# EAGLE design axiom_beta_plugin_module_3xmDP_v1.2_r1.4 (EAGLE 7.0.0)
Assembly variants: Beta
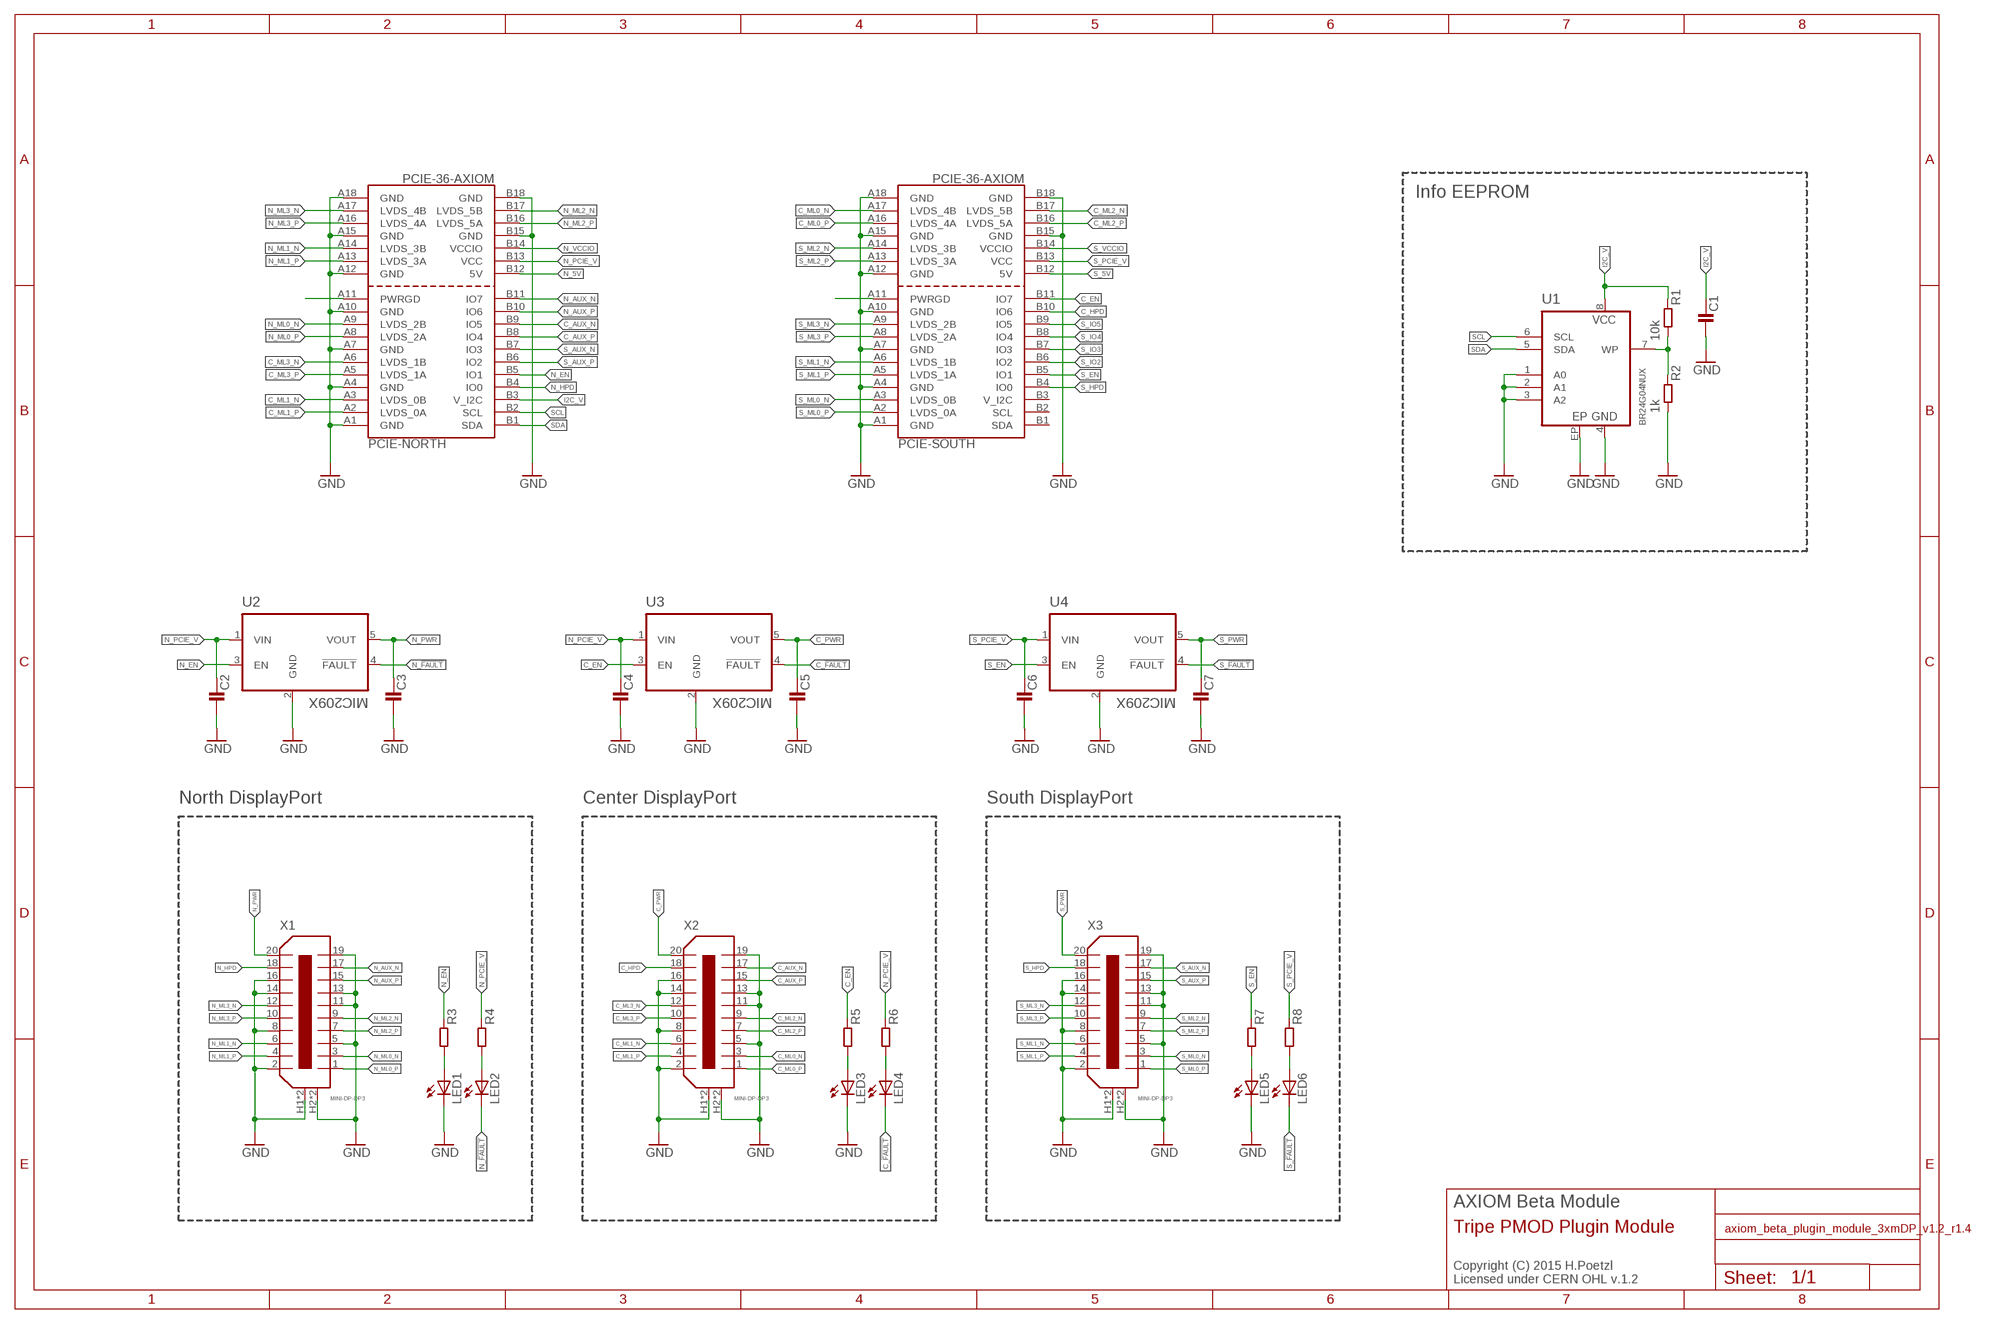
[diagram p0: schematic, sheet 1]

## Parts
C1  C0402-B  [0402-B]
C2  C0603-B  [0603-B]
C3  C0603-B  [0603-B]
C4  C0603-B  [0603-B]
C5  C0603-B  [0603-B]
C6  C0603-B  [0603-B]
C7  C0603-B  [0603-B]
LED1  LEDCHIPLED_0603  [CHIPLED_0603]
LED2  LEDCHIPLED_0603  [CHIPLED_0603]
LED3  LEDCHIPLED_0603  [CHIPLED_0603]
LED4  LEDCHIPLED_0603  [CHIPLED_0603]
LED5  LEDCHIPLED_0603  [CHIPLED_0603]
LED6  LEDCHIPLED_0603  [CHIPLED_0603]
PCIE-NORTH  PCIE-36-AXIOM  [PCIE-36-AXIOM]  (not fitted in variant Beta)
PCIE-SOUTH  PCIE-36-AXIOM  [PCIE-36-AXIOM]  (not fitted in variant Beta)
R1  10k  R0402-B  [0402-B]
R2  1k  R0402-B  [0402-B]
R3  R0402-B  [0402-B]
R4  R0402-B  [0402-B]
R5  R0402-B  [0402-B]
R6  R0402-B  [0402-B]
R7  R0402-B  [0402-B]
R8  R0402-B  [0402-B]
U1  BR24G04NUX  [DFN200X300X100-9N]
U2  MIC209X  [SOT95P280X145-5N]
U3  MIC209X  [SOT95P280X145-5N]
U4  MIC209X  [SOT95P280X145-5N]
X1  MINI-DP-DP3  [JAE-DP3]
X2  MINI-DP-DP3  [JAE-DP3]
X3  MINI-DP-DP3  [JAE-DP3]

## Nets
C_!FAULT: LED4.C U3.4(!FAULT)
C_AUX_N: PCIE-NORTH.B9(IO5) X2.17
C_AUX_P: PCIE-NORTH.B8(IO4) X2.15
C_EN: PCIE-SOUTH.B11(IO7) R5.1 U3.3(EN)
C_HPD: PCIE-SOUTH.B10(IO6) X2.18
C_ML0_N: PCIE-SOUTH.A17(LVDS_4B) X2.3
C_ML0_P: PCIE-SOUTH.A16(LVDS_4A) X2.1
C_ML1_N: PCIE-NORTH.A3(LVDS_0B) X2.6
C_ML1_P: PCIE-NORTH.A2(LVDS_0A) X2.4
C_ML2_N: PCIE-SOUTH.B17(LVDS_5B) X2.9
C_ML2_P: PCIE-SOUTH.B16(LVDS_5A) X2.7
C_ML3_N: PCIE-NORTH.A6(LVDS_1B) X2.12
C_ML3_P: PCIE-NORTH.A5(LVDS_1A) X2.10
C_PWR: C5.1 U3.5(VOUT) X2.20
GND: C1.2 C2.2 C3.2 C4.2 C5.2 C6.2 C7.2 LED1.C LED3.C LED5.C PCIE-NORTH.A1(GND) PCIE-NORTH.A4(GND) PCIE-NORTH.A7(GND) PCIE-NORTH.A10(GND) PCIE-NORTH.A12(GND) PCIE-NORTH.A15(GND) PCIE-NORTH.A18(GND) PCIE-NORTH.B15(GND) PCIE-NORTH.B18(GND) PCIE-SOUTH.A1(GND) PCIE-SOUTH.A4(GND) PCIE-SOUTH.A7(GND) PCIE-SOUTH.A10(GND) PCIE-SOUTH.A12(GND) PCIE-SOUTH.A15(GND) PCIE-SOUTH.A18(GND) PCIE-SOUTH.B15(GND) PCIE-SOUTH.B18(GND) R2.2 U1.1(A0) U1.2(A1) U1.3(A2) U1.4(GND) U1.EP U2.2(GND) U3.2(GND) U4.2(GND) X1.2 X1.5 X1.8 X1.11 X1.13 X1.14 X1.16 X1.19 X1.H1(M) X1.H2(M) X1.H3(M) X1.H4(M) X2.2 X2.5 X2.8 X2.11 X2.13 X2.14 X2.16 X2.19 X2.H1(M) X2.H2(M) X2.H3(M) X2.H4(M) X3.2 X3.5 X3.8 X3.11 X3.13 X3.14 X3.16 X3.19 X3.H1(M) X3.H2(M) X3.H3(M) X3.H4(M)
I2C_V: C1.1 PCIE-NORTH.B3(V_I2C) R1.1 U1.8(VCC)
N$196: LED3.A R5.2
N$197: LED4.A R6.2
N$198: LED1.A R3.2
N$202: LED2.A R4.2
N$209: PCIE-NORTH.A11(PWRGD)
N$216: R1.2 R2.1 U1.7(WP)
N$256: PCIE-SOUTH.A11(PWRGD)
N$324: LED5.A R7.2
N$325: LED6.A R8.2
N_5V: PCIE-NORTH.B12(5V)
N_!FAULT: LED2.C U2.4(!FAULT)
N_AUX_N: PCIE-NORTH.B11(IO7) X1.17
N_AUX_P: PCIE-NORTH.B10(IO6) X1.15
N_EN: PCIE-NORTH.B5(IO1) R3.1 U2.3(EN)
N_HPD: PCIE-NORTH.B4(IO0) X1.18
N_ML0_N: PCIE-NORTH.A9(LVDS_2B) X1.3
N_ML0_P: PCIE-NORTH.A8(LVDS_2A) X1.1
N_ML1_N: PCIE-NORTH.A14(LVDS_3B) X1.6
N_ML1_P: PCIE-NORTH.A13(LVDS_3A) X1.4
N_ML2_N: PCIE-NORTH.B17(LVDS_5B) X1.9
N_ML2_P: PCIE-NORTH.B16(LVDS_5A) X1.7
N_ML3_N: PCIE-NORTH.A17(LVDS_4B) X1.12
N_ML3_P: PCIE-NORTH.A16(LVDS_4A) X1.10
N_PCIE_V: C2.1 C4.1 PCIE-NORTH.B13(VCC) R4.1 R6.1 U2.1(VIN) U3.1(VIN)
N_PWR: C3.1 U2.5(VOUT) X1.20
N_VCCIO: PCIE-NORTH.B14(VCCIO)
S_5V: PCIE-SOUTH.B12(5V)
S_!FAULT: LED6.C U4.4(!FAULT)
S_AUX_N: PCIE-NORTH.B7(IO3) X3.17
S_AUX_P: PCIE-NORTH.B6(IO2) X3.15
S_EN: PCIE-SOUTH.B5(IO1) R7.1 U4.3(EN)
S_HPD: PCIE-SOUTH.B4(IO0) X3.18
S_IO2: PCIE-SOUTH.B6(IO2)
S_IO3: PCIE-SOUTH.B7(IO3)
S_IO4: PCIE-SOUTH.B8(IO4)
S_IO5: PCIE-SOUTH.B9(IO5)
S_ML0_N: PCIE-SOUTH.A3(LVDS_0B) X3.3
S_ML0_P: PCIE-SOUTH.A2(LVDS_0A) X3.1
S_ML1_N: PCIE-SOUTH.A6(LVDS_1B) X3.6
S_ML1_P: PCIE-SOUTH.A5(LVDS_1A) X3.4
S_ML2_N: PCIE-SOUTH.A14(LVDS_3B) X3.9
S_ML2_P: PCIE-SOUTH.A13(LVDS_3A) X3.7
S_ML3_N: PCIE-SOUTH.A9(LVDS_2B) X3.12
S_ML3_P: PCIE-SOUTH.A8(LVDS_2A) X3.10
S_PCIE_V: C6.1 PCIE-SOUTH.B13(VCC) R8.1 U4.1(VIN)
S_PWR: C7.1 U4.5(VOUT) X3.20
S_VCCIO: PCIE-SOUTH.B14(VCCIO)
SCL: PCIE-NORTH.B2(SCL) U1.6(SCL)
SDA: PCIE-NORTH.B1(SDA) U1.5(SDA)
Unconnected: PCIE-SOUTH.B1(SDA) PCIE-SOUTH.B2(SCL) PCIE-SOUTH.B3(V_I2C)

## Notes on the sheet
- Info EEPROM
- North DisplayPort | Center DisplayPort | South DisplayPort
- AXIOM Beta Module
- Tripe PMOD Plugin Module
- Copyright (C) 2015 H.Poetzl
  Licensed under CERN OHL v.1.2

## Library data of the parts
C1-C7 = generic-rcl:C
LED1-LED6 = led:LED: LED OSRAM: - CHIPLED LG R971, LG N971, LY N971, LG Q971, LY Q971, LO R971, LY R971 LH N974, LH R974 LS Q976, LO Q976, LY Q976 LO Q996 - Hyper CHIPLED LW Q18S LB Q993, LB Q99A, LB R99A - SideLED LS A670, LO A670, LY A670, LG A670, LP A670 LB A673, LV A673, LT A673, LW A673 LH A674 LY A675 LS A676, LA A676, LO A676, LY A676, LW A676 LS A679, LY A679, LG A679 - Hyper Micro SIDELED® LS Y876, LA Y876, LO Y876, LY Y876 LT Y87S - SmartLED LW L88C, LW L88S LB L89C, LB L89S, LG L890 LS L89K, LO L89K, LY L89K LS L896, LA L896, LO L896, LY L896 - TOPLED LS T670, LO T670, LY T670, LG T670, LP T670 LSG T670, LSP T670, LSY T670, LOP T670, LYG T670 LG T671, LOG T671, LSG T671 LB T673, LV T673, LT T673, LW T673 LH T674 LS T676, LA T676, LO T676, LY T676, LB T676, LH T676, LSB T676, LW T676 LB T67C, LV T67C, LT T67C, LS T67K, LO T67K, LY T67K, LW E67C LS E67B, LA E67B, LO E67B, LY E67B, LB E67C, LV E67C, LT E67C LW T67C LS T679, LY T679, LG T679 LS T770, LO T770, LY T770, LG T770, LP T770 LB T773, LV T773, LT T773, LW T773 LH T774 LS E675, LA E675, LY E675, LS T675 LS T776, LA T776, LO T776, LY T776, LB T776 LHGB T686 LT T68C, LB T68C - Hyper Mini TOPLED® LB M676 - Mini TOPLED Santana® LG M470 LS M47K, LO M47K, LY M47K Source: http://www.osram.convergy.de LUXEON: - LUMILED® LXK2-PW12-R00, LXK2-PW12-S00, LXK2-PW14-U00, LXK2-PW14-V00 LXK2-PM12-R00, LXK2-PM12-S00, LXK2-PM14-U00 LXK2-PE12-Q00, LXK2-PE12-R00, LXK2-PE12-S00, LXK2-PE14-T00, LXK2-PE14-U00 LXK2-PB12-K00, LXK2-PB12-L00, LXK2-PB12-M00, LXK2-PB14-N00, LXK2-PB14-P00, LXK2-PB14-Q00 LXK2-PR12-L00, LXK2-PR12-M00, LXK2-PR14-Q00, LXK2-PR14-R00 LXK2-PD12-Q00, LXK2-PD12-R00, LXK2-PD12-S00 LXK2-PH12-R00, LXK2-PH12-S00 LXK2-PL12-P00, LXK2-PL12-Q00, LXK2-PL12-R00 Source: www.luxeon.com KINGBRIGHT: KA-3528ASYC Source: www.kingbright.com
PCIE-NORTH PCIE-SOUTH = PCIe:PCIE-36-AXIOM
R1-R8 = generic-rcl:R
U1 = eeprom:BR24G04
U2-U4 = mic209x:MIC209X: Current Limiting Power Distribution Switches; MPN: MIC2090-1YM5TR; OC_FARNELL: 1924707; OC_NEWARK: 58T4896; PACKAGE: SOT-23-5; SUPPLIER: MICREL SEMICONDUCTOR
X1-X3 = displayport:MINI-DP: RIGHT ANGLE MINI-DISPLAYPORT RECEPTACLE Source: http://www.molex.com/pdm_docs/sd/1050810001_sd.pdf

## Net classes
0 default: width 0.152 mm, drill 0.254 mm, clearance 0.152 mm
1 LVDS: width 0.152 mm, drill 0.254 mm, clearance 0.152 mm

## Board
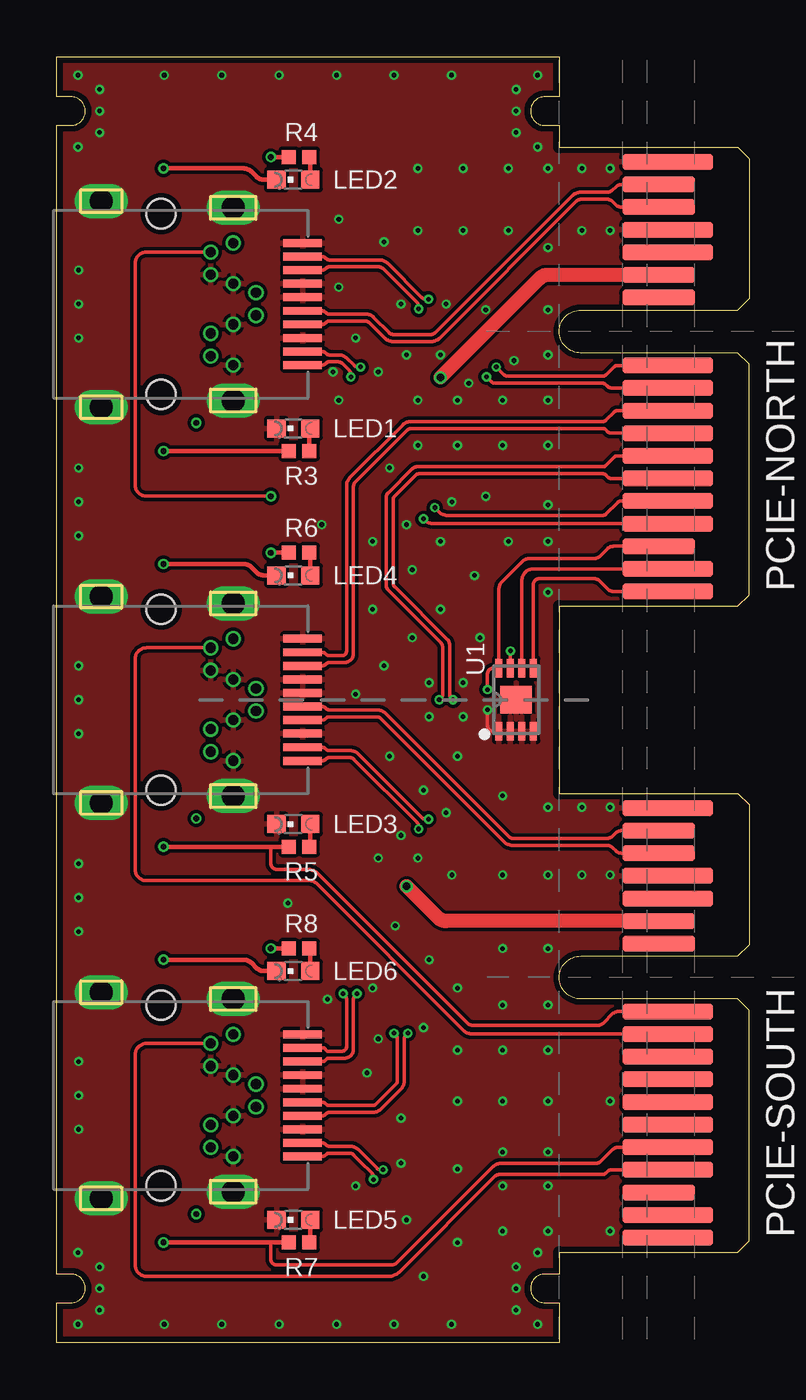
[diagram p1: board, top side]
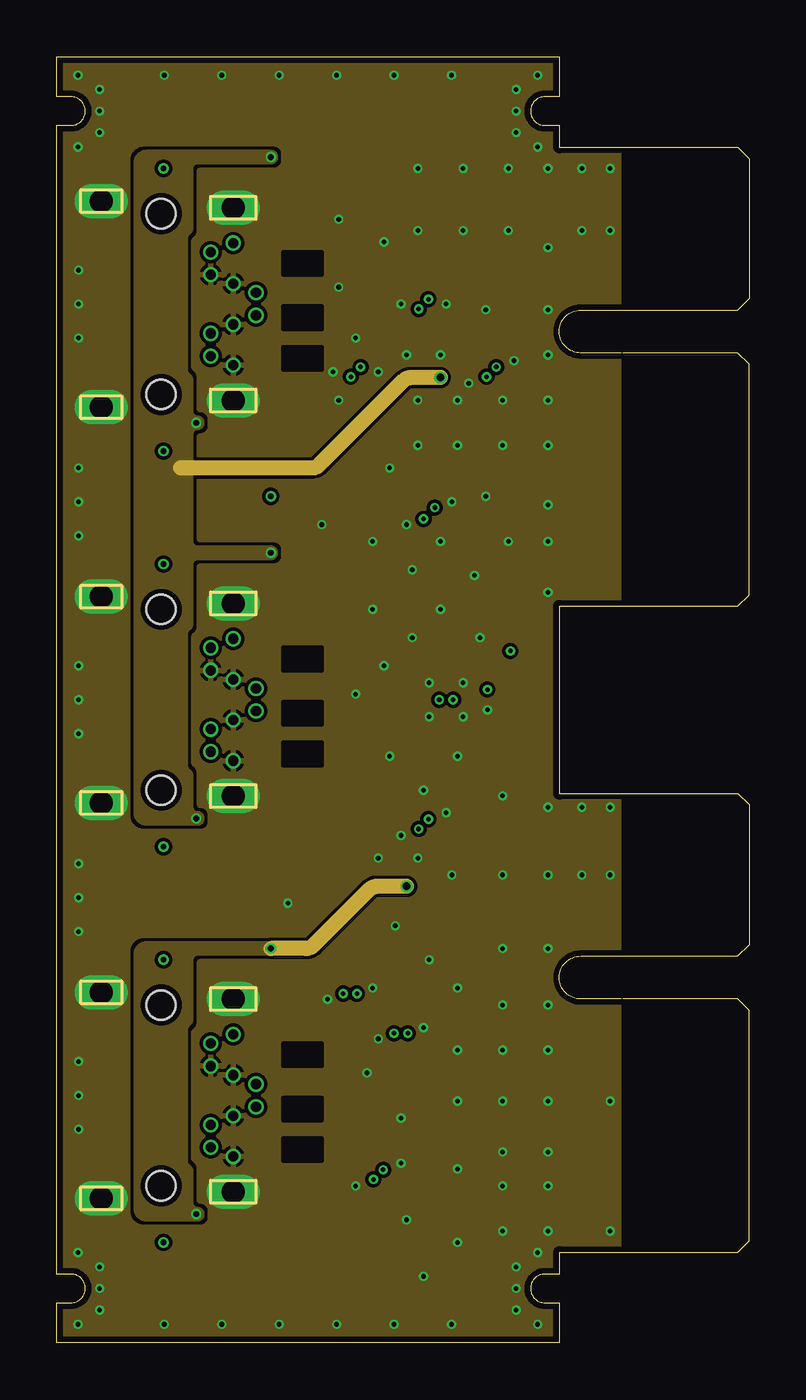
[diagram p2: board, inner layer Route2]
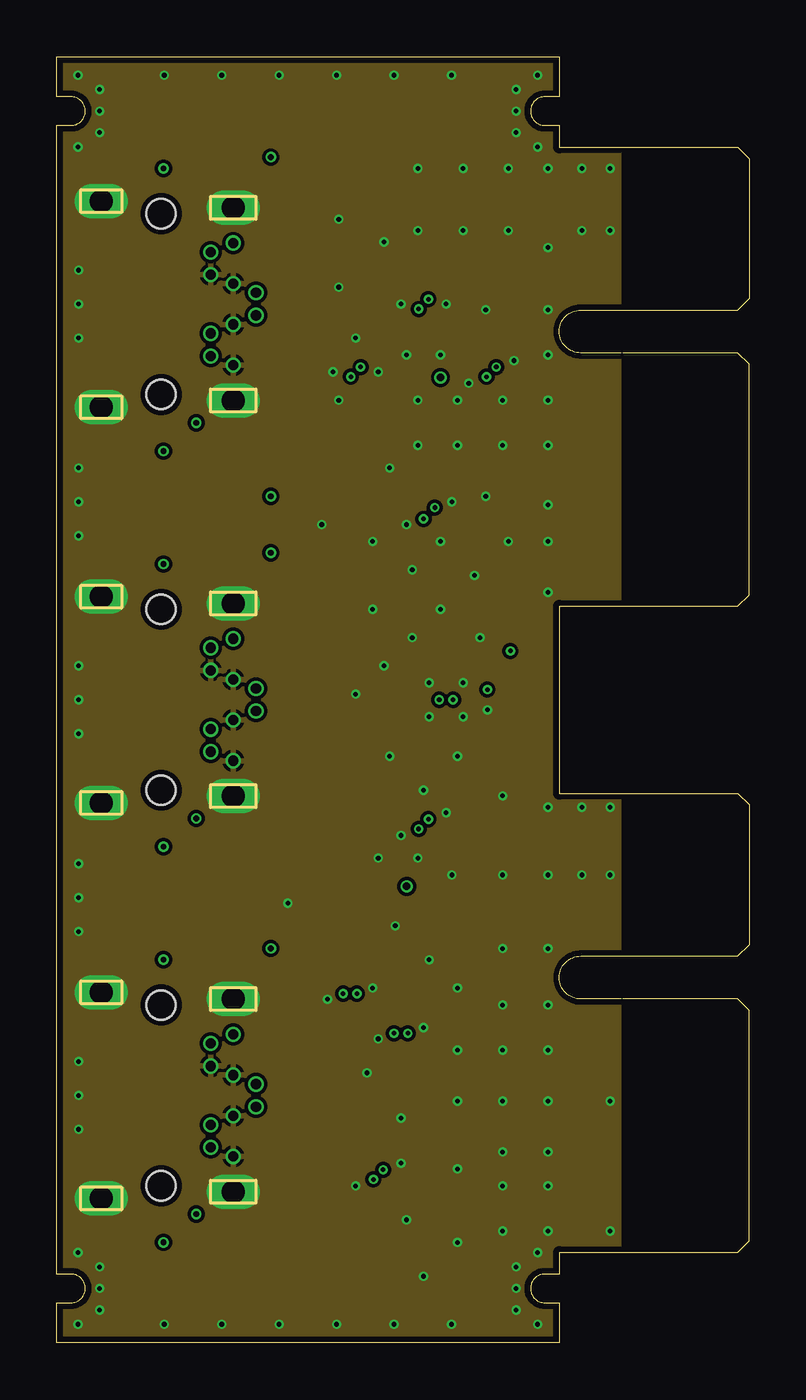
[diagram p3: board, inner layer Route15]
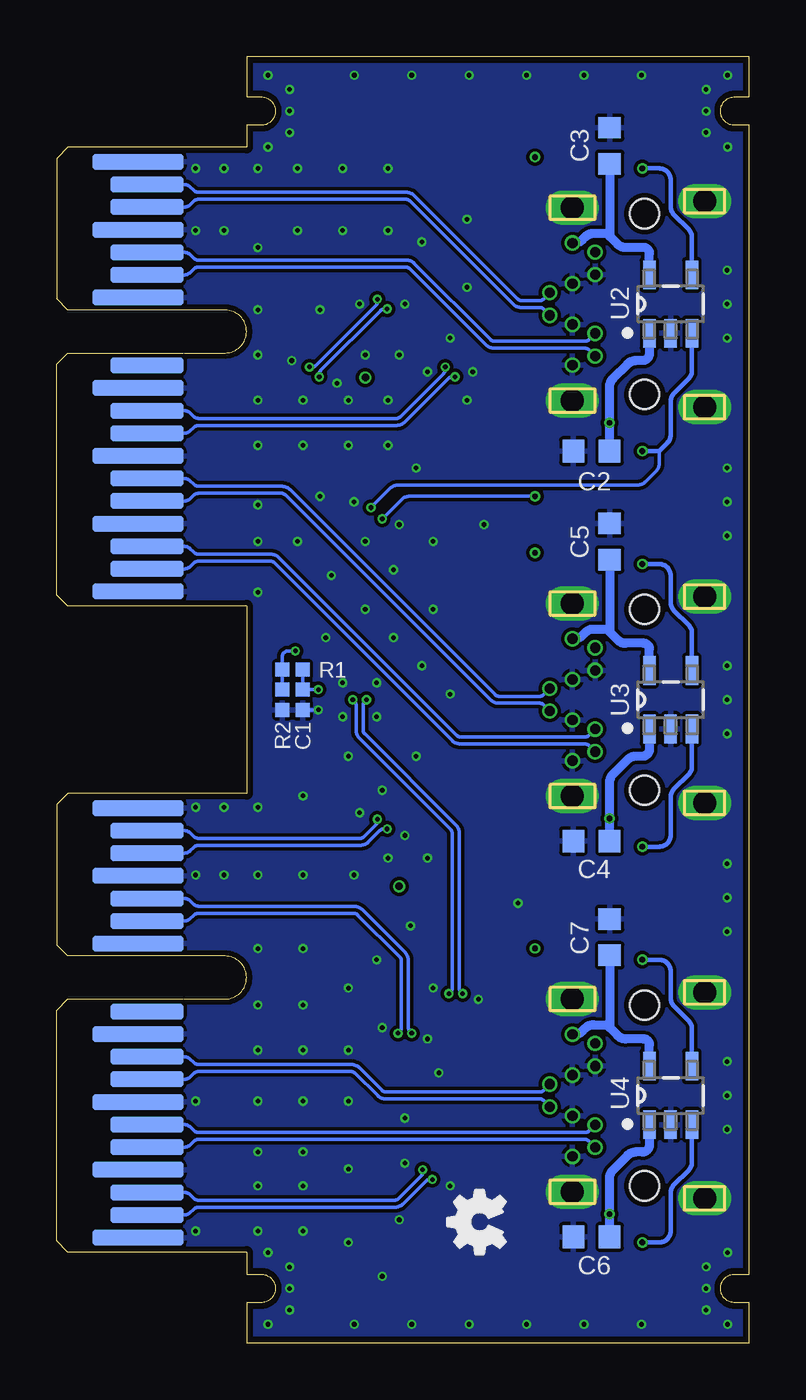
[diagram p4: board, bottom side, seen from below]

Size 30.62 x 56.9 mm. Coordinates in mm from the lower left corner, seen from the top.
Outline: 22.23,32.59 22.23,24.31
Outline: 22.23,52.89 22.23,53.85 21.59,53.85 arc-90 20.96,54.48 arc-90 21.59,55.12 22.23,55.12 22.23,56.9 0,56.9 0,55.12 0.64,55.12 arc-90 1.27,54.48 arc-90 0.64,53.85 0,53.85 0,3.05 0.64,3.05 arc-90 1.27,2.41 arc-90 0.64,1.78 0,1.78 0,0 22.23,0 22.23,1.78 21.59,1.78 arc-90 20.96,2.41 arc-90 21.59,3.05 22.23,3.05 22.23,4.01
Copper layers (1*2*15*16): Top 0.035559375mm / dielectric 0.17018125mm / Route2 0.01778125mm / dielectric 47mil / Route15 0.01778125mm / dielectric 0.17018125mm / Bottom 0.035559375mm
Design rules "OSHPark-4layer-tuned *": minimum track width 5mil, minimum drill 10mil, track to track 6mil, track to pad 5mil, pad to pad 5mil, via to via 5mil, smd to smd 5mil, copper to edge 10mil, drill to drill 6mil, minimum pad ring 4mil, minimum via ring 4mil, stop-mask expansion 2mil, vias tented up to drill 16mil, thermal gap 6mil
tKeepout: area 20,52.9 to 23.2,56.1; area 20,0.8 to 23.2,4; area -1,52.9 to 2.2,56.1; area -1,0.8 to 2.2,4
bKeepout: area 20,52.9 to 23.2,56.1; area 20,0.8 to 23.2,4; area -1,52.9 to 2.2,56.1; area -1,0.8 to 2.2,4

### Footprints (pad centres in the part's own frame; a part is rotated, then mirrored left to right if it is on the bottom)
0402-B = smd 0.62 x 0.62: 1 -0.45,0; 2 0.45,0
0603-B = smd 0.95 x 1: 1 -0.8,0; 2 0.8,0
CHIPLED_0603 = smd 0.8 x 0.8: A 0,-0.75; C 0,0.75
PCIE-36-AXIOM = smd 0.7 x 4 bottom: A1 -11.5,3.6; A4 -8.5,3.6; A7 -5.5,3.6; A10 -2.5,3.6; A12 1.5,3.6; A15 4.5,3.6; A18 7.5,3.6 | smd 0.7 x 3.2 bottom: A2 -10.5,4; A3 -9.5,4; A5 -7.5,4; A6 -6.5,4; A8 -4.5,4; A9 -3.5,4; A11 -1.5,4; A13 2.5,4; A14 3.5,4; A16 5.5,4; A17 6.5,4 | smd 0.7 x 4: B1 -11.5,3.6; B2 -10.5,3.6; B4 -8.5,3.6; B5 -7.5,3.6; B6 -6.5,3.6; B7 -5.5,3.6; B8 -4.5,3.6; B9 -3.5,3.6; B10 -2.5,3.6; B11 -1.5,3.6; B14 3.5,3.6; B15 4.5,3.6; B18 7.5,3.6 | smd 0.7 x 3.2: B3 -9.5,4; B12 1.5,4; B13 2.5,4; B16 5.5,4; B17 6.5,4
DFN200X300X100-9N = smd 0.813 x 0.305: 1 -1.397,0.762; 2 -1.397,0.254; 3 -1.397,-0.254; 4 -1.397,-0.762; 5 1.397,-0.762; 6 1.397,-0.254; 7 1.397,0.254; 8 1.397,0.762 | smd 1.194 x 1.397: EP 0,0
SOT95P280X145-5N = smd 1.27 x 0.559: 1 -1.295,0.94; 2 -1.295,0; 3 -1.295,-0.94; 4 1.295,-0.94; 5 1.295,0.94
JAE-DP3 = smd 0.35 x 1.7: 1 -2.7,-6.15; 3 -2.1,-6.15; 5 -1.5,-6.15; 7 -0.9,-6.15; 9 -0.3,-6.15; 11 0.3,-6.15; 13 0.9,-6.15; 15 1.5,-6.15; 17 2.1,-6.15; 19 2.7,-6.15 | drill 0.45: 2 -2.7,-3.09; 4 -2.3,-2.09; 6 -1.3,-2.09; 8 -0.9,-3.09; 10 -0.5,-4.09; 12 0.5,-4.09; 14 0.9,-3.09; 16 1.3,-2.09; 18 2.3,-2.09; 20 2.7,-3.09 | drill 1.016 long: H1 -4.26,-3.09; H2 -4.56,2.75; H3 4.56,2.75; H4 4.26,-3.09 | hole 1.3: -4,0.1; 4,0.1

### Placement (x,y rotation side)
C1  19.75,28.45 270 bottom
C2  6.98,39.45 180 bottom
C3  6.18,52.95 90 bottom
C4  6.98,22.2 180 bottom
C5  6.18,35.45 90 bottom
C6  6.98,4.7 180 bottom
C7  6.18,17.95 90 bottom
LED1  10.48,40.45 90 top
LED2  10.48,51.45 90 top
LED3  10.48,22.95 90 top
LED4  10.48,33.95 90 top
LED5  10.48,5.45 90 top
LED6  10.48,16.45 90 top
LOGO1  OSHW_LOGO_FILLX0100-NT  [OSHW_FILLX100_NOTEXT]  10.8,3.94 90 bottom
PCIE-NORTH  30.62,44.74 90 top
PCIE-SOUTH  30.62,16.16 90 top
R1  20.19,29.78 180 bottom
R2  20.64,28.45 270 bottom
R3  10.73,39.45 0 top
R4  10.73,52.45 0 top
R5  10.73,21.95 0 top
R6  10.73,34.95 0 top
R7  10.73,4.45 0 top
R8  10.73,17.45 0 top
U1  20.32,28.45 90 top
U2  3.48,45.95 90 bottom
U3  3.48,28.45 90 bottom
U4  3.48,10.95 90 bottom
X1  4.73,45.95 90 top
X2  4.73,28.45 90 top
X3  4.73,10.95 90 top

### Tracks (layer width: path | path; a pad name or v marks a point on that pad's centre or on a via)
C_!FAULT  (via drill 0.25)
  Top 0.203: LED4.C 9.18,33.95 arc-45 8.83,34.09 8.62,34.3 arc45 8.27,34.45 v4.73,34.45
  Bottom 0.203: v4.73,34.45 3.98,34.45 arc90 3.48,33.95 3.48,32.76 arc-45 3.33,32.4 2.68,31.75 arc45 2.54,31.4 U3.4
C_AUX_N
  Top 0.152: PCIE-NORTH.B9 24.79,41.23 arc45 24.65,41.18 24.28,40.81 arc-45 24.14,40.75 15.66,40.75 arc45 15.3,40.6 12.97,38.27 arc45 12.82,37.92 12.82,30.6 arc-90 12.62,30.4 12.06,30.4 arc-45 11.92,30.46 11.89,30.49 arc45 11.75,30.55 X2.17
C_AUX_P
  Top 0.152: PCIE-NORTH.B8 24.52,40.23 arc-45 24.38,40.29 24.28,40.39 arc45 24.14,40.45 15.7,40.45 arc45 15.49,40.36 13.22,38.09 arc45 13.13,37.87 13.13,30.5 arc-90 12.73,30.1 12.06,30.1 arc45 11.92,30.04 11.89,30.01 arc-45 11.75,29.95 X2.15
C_EN  (via drill 0.25)
  Top 0.152: PCIE-SOUTH.B11 24.85,14.66 arc45 24.58,14.55 24.19,14.16 arc-45 23.92,14.05 18.42,14.05 arc-45 18.15,14.16 11.55,20.76 arc45 11.1,20.95 9.73,20.95 arc-90 9.48,21.2 9.48,21.95
  Top 0.203: R5.1 9.48,21.95 v4.73,21.95
  Bottom 0.203: v4.73,21.95 3.98,21.95 arc-90 3.48,22.45 3.48,24.14 arc45 3.33,24.49 2.68,25.14 arc-45 2.54,25.5 U3.3
C_HPD
  Top 0.152: PCIE-SOUTH.B10 18.41,13.66 arc-45 17.96,13.85 11.47,20.34 arc45 11.2,20.45 3.98,20.45 arc-90 3.48,20.96 3.48,30.24 arc-90 3.98,30.75 X2.18
C_ML0_N  (via drill 0.2)
  Top 0.152: X2.3 11.75,26.35 arc-45 11.89,26.29 11.92,26.26 arc45 12.06,26.2 12.98,26.2 arc-45 13.34,26.05 16.15,23.24 arc45 16.33,23.16 v16.44,23.16
  Bottom 0.152: PCIE-SOUTH.A17 24.98,22.66 arc45 24.72,22.55 24.59,22.42 arc-45 24.32,22.31 17.24,22.31 arc-45 17.03,22.4 16.51,22.91 arc-45 16.44,23.09 v16.44,23.16
C_ML0_P  (via drill 0.2)
  Top 0.152: X2.1 11.75,25.75 arc45 11.89,25.81 11.92,25.84 arc-45 12.06,25.9 12.94,25.9 arc-45 13.15,25.81 15.94,23.02 arc-45 16.01,22.84 v16.01,22.73
  Bottom 0.152: PCIE-SOUTH.A16 24.98,21.66 arc-45 24.72,21.77 24.59,21.9 arc45 24.32,22.01 17.19,22.01 arc-45 16.84,22.16 16.34,22.66 arc45 16.16,22.73 v16.01,22.73
C_ML1_N
  Bottom 0.152: PCIE-NORTH.A3 24.98,35.23 arc45 24.72,35.12 24.59,35 arc-45 24.32,34.89 21.16,34.89 arc45 20.8,34.74 12.94,26.87 arc-45 12.76,26.8 7.27,26.8 arc-45 7.09,26.87 X2.6
C_ML1_P
  Bottom 0.152: PCIE-NORTH.A2 24.98,34.23 arc-45 24.72,34.35 24.59,34.47 arc45 24.32,34.58 21.2,34.58 arc45 20.99,34.49 13.14,26.64 arc-45 12.78,26.5 7.27,26.5 arc45 7.09,26.42 X2.4
C_ML2_N
  Top 0.152: PCIE-SOUTH.B17 24.98,22.66 arc45 24.72,22.55 24.59,22.42 arc-45 24.32,22.31 20.2,22.31 arc-45 19.99,22.4 14.54,27.85 arc45 14.18,28 12.06,28 arc-45 11.92,28.06 11.89,28.09 arc45 11.75,28.15 X2.9
C_ML2_P
  Top 0.152: PCIE-SOUTH.B16 24.98,21.66 arc-45 24.72,21.77 24.59,21.9 arc45 24.32,22.01 20.16,22.01 arc-45 19.8,22.16 14.35,27.61 arc45 14.14,27.7 12.06,27.7 arc45 11.92,27.64 11.89,27.61 arc-45 11.75,27.55 X2.7
C_ML3_N
  Bottom 0.152: PCIE-NORTH.A6 24.98,38.23 arc45 24.72,38.12 24.59,38 arc-45 24.32,37.89 20.66,37.89 arc45 20.3,37.74 11.24,28.67 arc-45 11.06,28.6 9.27,28.6 arc-45 9.09,28.67 X2.12
C_ML3_P
  Bottom 0.152: PCIE-NORTH.A5 24.98,37.23 arc-45 24.72,37.35 24.59,37.47 arc45 24.32,37.58 20.7,37.58 arc45 20.49,37.5 11.44,28.44 arc-45 11.08,28.3 9.27,28.3 arc45 9.09,28.22 X2.10
C_PWR
  Bottom 0.406: X2.20 7.73,31.15 arc-45 7.38,31.29 7.25,31.43 arc45 6.89,31.57 6.3,31.57 6.18,31.45 | U3.5 4.42,30.7 arc-90 4.67,30.95 5.47,30.95 arc45 5.82,31.09 6.18,31.45 | C5.1 6.18,31.45
GND  (via drill 0.2)
  Top 0.152: U1.1 19.3,27.05 arc-90 19.05,27.3 v19.05,28
  Bottom 0.152: v19.05,28 C1.2
  other vias: 21.27,0.83 20.32,1.46 20.32,2.41 20.32,3.37 21.27,4 21.27,56.07 21.27,52.9 20.32,53.53 20.32,55.44 20.32,54.48 0.95,56.07 0.95,0.83 4.76,56.07 17.46,56.07 4.76,0.83 0.95,4 0.95,52.9 1.91,53.53 17.46,0.83 7.3,56.07 9.84,56.07 12.38,56.07 1.91,55.44 1.91,1.46 1.91,3.37 9.84,0.83 12.38,0.83 7.3,0.83 14.92,0.83 1.91,54.48 1.91,2.41 14.92,56.07 0.98,38.7 0.98,35.7 0.98,37.2 24.48,49.2 24.48,51.95 24.48,23.7 24.48,20.7 0.98,47.45 0.98,44.45 0.98,45.95 0.98,29.95 0.98,26.95 0.98,28.45 0.98,21.2 0.98,18.2 0.98,19.7 0.98,12.45 0.98,9.45 0.98,10.95 15.23,45.95 14.23,42.95 17.23,45.95 12.23,42.95 18.23,42.45 20.23,43.45 15.48,36.2 17.48,37.2 16.48,29.2 16.48,27.7 17.98,27.7 17.98,29.2 15.23,22.45 17.23,23.45 14.23,13.45 16.23,13.95 11.98,15.2 13.98,15.7 13.23,6.95 15.23,7.95 24.48,10.7 21.73,6.95 21.73,10.7 21.73,12.95 21.73,17.45 21.73,14.95 17.73,7.7 19.73,10.7 19.73,20.7 17.73,15.7 21.73,35.45 21.73,39.7 21.73,43.7 21.73,41.7 19.98,49.2 18.98,45.7 21.73,45.7 15.73,31.2 14.48,29.95 16.98,32.45 18.48,33.95 19.98,35.45 13.98,32.45 13.98,35.45 14.73,38.7 17.73,39.7 19.73,39.7 17.98,49.2 14.48,48.7 12.48,46.7 13.23,44.45 16.98,43.7 15.48,43.7 15.98,41.7 17.73,41.7 19.73,41.7 19.73,12.95 13.23,28.7 21.73,23.7 21.73,20.7 17.48,20.7 15.98,21.45 14.23,21.45 19.73,24.2 15.98,39.7 15.98,49.2 21.73,51.95 19.98,51.95 17.98,51.95 15.98,51.95 12.48,49.7 12.48,41.7 11.73,36.2 14.73,25.95 16.23,24.45 17.73,25.95 15.73,34.2 16.98,35.45 18.98,37.45 21.73,37.07 23.23,49.2 19.73,17.45 16.48,16.95 19.73,14.95 14.98,18.45 10.23,19.45 15.23,9.95 17.73,10.7 23.23,23.7 23.23,20.7 23.23,51.95 21.73,48.45 21.73,4.95 19.73,4.95 17.73,4.45 16.23,2.95 15.48,5.45 19.73,6.95 21.73,8.45 17.73,12.95 13.73,11.95 19.73,8.45 18.73,31.2 21.73,33.2 24.48,4.95
  pour Top (isolate 0.152): 0.03,56.9 22.23,56.9 22.23,53.21 25.4,53.21 25.4,3.68 22.23,3.68 22.23,0 0.03,0
  pour Bottom (isolate 0.152): 0.03,56.9 22.23,56.9 22.23,53.21 25.4,53.21 25.4,3.68 22.23,3.68 22.23,0 0.03,0
  pour Route2 (isolate 0.152, rank 3): 0.03,56.9 22.23,56.9 22.23,53.21 24.9,53.21 24.9,3.68 22.23,3.68 22.23,0 0.03,0
  pour Route15 (isolate 0.152): 0.03,56.9 22.23,56.9 22.23,53.21 24.9,53.21 24.9,3.68 22.23,3.68 22.23,0 0.03,0
I2C_V  (via drill 0.2)
  Top 0.152: v19.05,28.9 19.05,29.59 arc-90 19.3,29.84 U1.8 19.56,33.33 arc-45 19.7,33.68 20.57,34.55 arc-45 20.93,34.7 23.76,34.7 arc45 24.03,34.81 24.35,35.12 arc-45 24.62,35.23 PCIE-NORTH.B3
  Bottom 0.152: v19.05,28.9 C1.1 R1.1
N$1
  cutout Route2: 10.03,30.75 11.73,30.75 11.73,29.75 10.03,29.75
  cutout Route2: 10.03,28.35 11.73,28.35 11.73,27.35 10.03,27.35
  cutout Route2: 10.03,26.55 11.73,26.55 11.73,25.55 10.03,25.55
N$2
  cutout Route2: 10.03,48.25 11.73,48.25 11.73,47.25 10.03,47.25
  cutout Route2: 10.03,45.85 11.73,45.85 11.73,44.85 10.03,44.85
  cutout Route2: 10.03,44.05 11.73,44.05 11.73,43.05 10.03,43.05
N$3
  cutout Route2: 10.03,13.25 11.73,13.25 11.73,12.25 10.03,12.25
  cutout Route2: 10.03,10.85 11.73,10.85 11.73,9.85 10.03,9.85
  cutout Route2: 10.03,9.05 11.73,9.05 11.73,8.05 10.03,8.05
N$196
  Top 0.203: LED3.A 11.23,21.95 R5.2
N$197
  Top 0.203: LED4.A 11.23,34.95 R6.2
N$198
  Top 0.203: R3.2 11.18,40.45 LED1.A
N$202
  Top 0.203: LED2.A 11.23,52.45 R4.2
N$216  (via drill 0.2)
  Top 0.152: U1.7 v20.07,30.61
  Bottom 0.152: R2.1 R1.2 20.64,30.35 arc90 20.39,30.61 v20.07,30.61
N$324
  Top 0.203: LED5.A 11.23,4.45 R7.2
N$325
  Top 0.203: LED6.A 11.23,17.45 R8.2
N_!FAULT  (via drill 0.25)
  Top 0.203: LED2.C 9.18,51.45 arc-45 8.83,51.59 8.62,51.8 arc45 8.27,51.95 v4.73,51.95
  Bottom 0.203: v4.73,51.95 3.98,51.95 arc90 3.48,51.45 3.48,50.25 arc-45 3.33,49.9 2.68,49.25 arc45 2.54,48.9 U2.4
N_AUX_N  (via drill 0.2)
  Top 0.152: PCIE-NORTH.B11 24.81,43.23 arc45 24.64,43.16 24.3,42.82 arc-45 24.12,42.75 19.96,42.75 arc-45 19.78,42.82 v19.44,43.16 | v16.44,46.16 16.33,46.16 arc-45 16.15,46.24 14.64,47.75 arc45 14.28,47.9 12.06,47.9 arc-45 11.92,47.96 11.89,47.99 arc45 11.75,48.05 X1.17
  Bottom 0.152: v19.44,43.16 19.33,43.16 arc-45 19.15,43.24 16.51,45.88 arc-45 16.44,46.05 v16.44,46.16
N_AUX_P  (via drill 0.2)
  Top 0.152: PCIE-NORTH.B10 24.54,42.23 arc-45 24.36,42.31 24.3,42.37 arc45 24.12,42.45 19.4,42.45 arc-45 19.22,42.52 v19.01,42.73 | v16.01,45.73 16.01,45.84 arc45 15.94,46.02 14.45,47.51 arc45 14.24,47.6 12.06,47.6 arc45 11.92,47.54 11.89,47.51 arc-45 11.75,47.45 X1.15
  Bottom 0.152: v19.01,42.73 19.01,42.84 arc45 18.94,43.02 16.3,45.66 arc45 16.12,45.73 v16.01,45.73
N_EN  (via drill 0.2, 0.25)
  Top 0.152: v16.73,36.95 16.93,36.75 arc45 17.28,36.6 24.14,36.6 arc45 24.28,36.66 24.8,37.18 arc-45 24.95,37.23 PCIE-NORTH.B5
  Top 0.203: R3.1 v4.73,39.45
  Bottom 0.152: v16.73,36.95 15.87,37.8 arc45 15.52,37.95 4.93,37.95 arc-45 4.58,38.09 4.12,38.55 arc-45 3.98,38.91 3.98,39.45
  Bottom 0.203: v4.73,39.45 3.98,39.45 3.62,39.8 arc-45 3.48,40.16 3.48,41.64 arc45 3.33,41.99 2.68,42.64 arc-45 2.54,43 U2.3
N_HPD  (via drill 0.2, 0.25)
  Top 0.152: PCIE-NORTH.B4 16.65,36.23 arc-45 16.29,36.38 v16.23,36.45 | v9.48,37.45 3.98,37.45 arc-90 3.48,37.96 3.48,47.74 arc-90 3.98,48.25 X1.18
  Bottom 0.152: v16.23,36.45 15.37,37.3 arc45 15.02,37.45 v9.48,37.45
N_ML0_N  (via drill 0.2)
  Top 0.152: X1.3 11.75,43.85 arc-45 11.89,43.79 11.92,43.76 arc45 12.06,43.7 12.48,43.7 arc-45 12.84,43.55 13.15,43.24 arc45 13.33,43.16 v13.44,43.16
  Bottom 0.152: PCIE-NORTH.A9 24.98,41.23 arc45 24.72,41.12 24.59,41 arc-45 24.32,40.89 15.63,40.89 arc-45 15.41,40.98 13.51,42.88 arc-45 13.44,43.05 v13.44,43.16
N_ML0_P  (via drill 0.2)
  Top 0.152: X1.1 11.75,43.25 arc45 11.89,43.31 11.92,43.34 arc-45 12.06,43.4 12.44,43.4 arc-45 12.65,43.31 12.94,43.02 arc-45 13.01,42.84 v13.01,42.73
  Bottom 0.152: PCIE-NORTH.A8 24.98,40.23 arc-45 24.72,40.35 24.59,40.47 arc45 24.32,40.58 15.58,40.58 arc-45 15.23,40.73 13.3,42.66 arc45 13.12,42.73 v13.01,42.73
N_ML1_N
  Bottom 0.152: PCIE-NORTH.A14 24.98,48.24 arc45 24.72,48.12 24.59,48 arc-45 24.32,47.89 15.16,47.89 arc45 14.8,47.74 11.44,44.37 arc-45 11.26,44.3 7.27,44.3 arc-45 7.09,44.37 X1.6
N_ML1_P
  Bottom 0.152: PCIE-NORTH.A13 24.98,47.24 arc-45 24.72,47.35 24.59,47.47 arc45 24.32,47.58 15.2,47.58 arc45 14.99,47.5 11.64,44.14 arc-45 11.28,44 7.27,44 arc45 7.09,43.92 X1.4
N_ML2_N
  Top 0.152: PCIE-NORTH.B17 24.98,51.24 arc45 24.72,51.12 24.59,51 arc-45 24.32,50.89 23.16,50.89 arc45 22.8,50.74 16.75,44.69 arc-45 16.54,44.6 14.91,44.6 arc-45 14.7,44.69 14.04,45.35 arc45 13.68,45.5 12.06,45.5 arc-45 11.92,45.56 11.89,45.59 arc45 11.75,45.65 X1.9
N_ML2_P
  Top 0.152: PCIE-NORTH.B16 24.98,50.24 arc-45 24.72,50.35 24.59,50.47 arc45 24.32,50.58 23.2,50.58 arc45 22.99,50.5 16.94,44.44 arc-45 16.58,44.3 14.87,44.3 arc-45 14.52,44.44 13.85,45.11 arc45 13.64,45.2 12.06,45.2 arc45 11.92,45.14 11.89,45.11 arc-45 11.75,45.05 X1.7
N_ML3_N
  Bottom 0.152: PCIE-NORTH.A17 24.98,51.24 arc45 24.72,51.12 24.59,51 arc-45 24.32,50.89 15.16,50.89 arc45 14.8,50.74 10.24,46.17 arc-45 10.06,46.1 9.27,46.1 arc-45 9.09,46.17 X1.12
N_ML3_P
  Bottom 0.152: PCIE-NORTH.A16 24.98,50.24 arc-45 24.72,50.35 24.59,50.47 arc45 24.32,50.58 15.2,50.58 arc45 14.99,50.5 10.44,45.94 arc-45 10.08,45.8 9.27,45.8 arc45 9.09,45.72 X1.10
N_PCIE_V  (via drill 0.25, 0.33)
  Top 0.203: R6.1 v9.48,34.95 | R4.1 v9.48,52.45
  Top 0.61: PCIE-NORTH.B13 21.72,47.24 arc45 21.37,47.09 v16.98,42.7
  Route2 0.652: v16.98,42.7 15.68,42.7 arc45 15.33,42.55 11.62,38.84 arc-45 11.27,38.7 5.48,38.7
  Bottom 0.406: C4.1 v6.18,23.2 6.18,24.79 arc45 6.03,25.14 5.37,25.8 arc45 5.02,25.95 4.73,25.95 arc-90 4.42,26.26 U3.1 | C2.1 v6.18,40.7 6.18,42.29 arc45 6.03,42.64 5.37,43.3 arc45 5.02,43.45 4.73,43.45 arc-90 4.42,43.76 U2.1
  pour Route2: 3.48,23.46 3.48,52.19 arc-90 3.98,52.7 9.47,52.7 arc-90 9.73,52.44 arc-90 9.48,52.2 6.23,52.2 arc90 5.98,51.94 5.98,49.3 arc-45 5.9,49.12 5.8,49.02 arc45 5.73,48.84 5.73,43.05 arc45 5.8,42.87 5.9,42.77 arc-45 5.98,42.59 5.98,41.2 arc90 6.23,40.95 arc-90 6.48,40.7 6.48,40.69 arc-90 6.23,40.45 arc90 5.98,40.19 5.98,35.45 arc90 6.23,35.2 9.47,35.2 arc-90 9.73,34.94 arc-90 9.48,34.7 6.23,34.7 arc90 5.98,34.44 5.98,31.8 arc-45 5.9,31.62 5.8,31.52 arc45 5.73,31.34 5.73,25.55 arc45 5.8,25.37 5.9,25.27 arc-45 5.98,25.09 5.98,23.7 arc90 6.23,23.45 arc-90 6.48,23.2 arc-90 6.22,22.95 3.98,22.95 arc-90
N_PWR
  Bottom 0.406: X1.20 7.73,48.65 arc-45 7.38,48.79 7.25,48.93 arc45 6.89,49.07 6.3,49.07 6.18,48.95 | U2.5 4.42,48.2 arc-90 4.67,48.45 5.47,48.45 arc45 5.82,48.59 6.18,48.95 | C3.1 6.18,48.95
S_!FAULT  (via drill 0.25)
  Top 0.203: LED6.C 9.18,16.45 arc-45 8.83,16.59 8.62,16.8 arc45 8.27,16.95 v4.73,16.95
  Bottom 0.203: v4.73,16.95 3.98,16.95 arc90 3.48,16.45 3.48,15.26 arc-45 3.33,14.9 2.68,14.26 arc45 2.54,13.9 U4.4
S_AUX_N  (via drill 0.2)
  Top 0.152: PCIE-NORTH.B7 24.79,39.23 arc45 24.65,39.18 24.28,38.81 arc-45 24.14,38.75 15.94,38.75 arc45 15.73,38.66 14.66,37.6 arc45 14.57,37.39 14.57,33.51 arc45 14.66,33.3 16.98,30.97 arc-45 17.07,30.76 17.07,28.69 arc-50 16.98,28.5 v16.92,28.45 | X3.17 11.83,13.05 11.98,12.9 12.62,12.9 arc90 12.82,13.1 12.82,15.2 arc50 12.73,15.4 v12.67,15.45
  Bottom 0.152: v16.92,28.45 17,28.37 arc-45 17.07,28.19 17.07,27.14 arc-45 16.98,26.92 12.97,22.91 arc45 12.82,22.55 12.82,15.7 arc-45 12.75,15.53 v12.67,15.45
S_AUX_P  (via drill 0.2)
  Top 0.152: PCIE-NORTH.B6 24.52,38.23 arc-45 24.38,38.29 24.28,38.39 arc45 24.14,38.45 16.06,38.45 arc45 15.85,38.36 14.97,37.47 arc45 14.88,37.26 14.88,33.63 arc45 14.97,33.42 17.29,31.1 arc-45 17.38,30.89 17.38,28.69 arc50 17.47,28.5 v17.53,28.45 | X3.15 11.83,12.45 11.98,12.6 12.73,12.6 arc90 13.13,13 13.13,15.2 arc-50 13.22,15.4 v13.28,15.45
  Bottom 0.152: v17.53,28.45 17.45,28.37 arc45 17.38,28.19 17.38,27.09 arc-45 17.23,26.74 13.22,22.72 arc45 13.13,22.51 13.13,15.7 arc45 13.2,15.53 v13.28,15.45
S_EN  (via drill 0.25)
  Top 0.152: PCIE-SOUTH.B5 24.85,8.66 arc45 24.58,8.55 24.05,8.02 arc-45 23.87,7.95 19.66,7.95 arc45 19.31,7.8 15.07,3.56 arc-45 14.8,3.45 9.73,3.45 arc-90 9.48,3.7 9.48,4.45
  Top 0.203: R7.1 9.48,4.45 v4.73,4.45
  Bottom 0.203: v4.73,4.45 3.98,4.45 arc-90 3.48,4.95 3.48,6.64 arc45 3.33,6.99 2.68,7.64 arc-45 2.54,8 U4.3
S_HPD
  Top 0.152: X3.18 3.98,13.25 arc90 3.48,12.74 3.48,3.46 arc90 3.98,2.95 14.69,2.95 arc45 15.14,3.13 19.38,7.38 arc-45 19.56,7.45 24.12,7.45 arc45 24.3,7.52 24.36,7.59 arc-45 24.54,7.66 PCIE-SOUTH.B4
S_ML0_N  (via drill 0.2)
  Top 0.152: X3.3 11.75,8.85 arc-45 11.89,8.79 11.92,8.76 arc45 12.06,8.7 12.98,8.7 arc-45 13.34,8.55 14.15,7.74 arc45 14.33,7.66 v14.44,7.66
  Bottom 0.152: PCIE-SOUTH.A3 24.98,6.66 arc45 24.72,6.55 24.59,6.42 arc-45 24.32,6.31 15.7,6.31 arc-45 15.49,6.4 14.51,7.38 arc-45 14.44,7.55 v14.44,7.66
S_ML0_P  (via drill 0.2)
  Top 0.152: X3.1 11.75,8.25 arc45 11.89,8.31 11.92,8.34 arc-45 12.06,8.4 12.94,8.4 arc-45 13.15,8.31 13.44,8.02 13.94,7.52 arc-45 14.01,7.34 v14.01,7.23
  Bottom 0.152: PCIE-SOUTH.A2 24.98,5.66 arc-45 24.72,5.77 24.59,5.9 arc45 24.32,6.01 15.66,6.01 arc-45 15.3,6.16 14.3,7.16 arc45 14.12,7.23 v14.01,7.23
S_ML1_N
  Bottom 0.152: PCIE-SOUTH.A6 24.98,9.66 arc45 24.72,9.55 24.59,9.42 arc-45 24.32,9.31 7.25,9.31 arc-45 7.08,9.39 X3.6
S_ML1_P
  Bottom 0.152: PCIE-SOUTH.A5 24.98,8.66 arc-45 24.72,8.77 24.59,8.9 arc45 24.32,9.01 7.28,9.01 arc45 7.1,8.93 X3.4
S_ML2_N  (via drill 0.2)
  Top 0.152: X3.9 11.75,10.65 arc-45 11.89,10.59 11.92,10.56 arc45 12.06,10.5 13.94,10.5 arc45 14.15,10.59 14.99,11.42 arc45 15.07,11.64 15.07,13.45 arc50 14.98,13.65 v14.92,13.7
  Bottom 0.152: PCIE-SOUTH.A14 24.98,19.66 arc45 24.72,19.55 24.59,19.42 arc-45 24.32,19.31 17.47,19.31 arc45 17.12,19.17 15.22,17.27 arc45 15.07,16.92 15.07,13.95 arc-45 15,13.78 v14.92,13.7
S_ML2_P  (via drill 0.2)
  Top 0.152: X3.7 11.75,10.05 arc45 11.89,10.11 11.92,10.14 arc-45 12.06,10.2 13.98,10.2 arc45 14.34,10.34 15.23,11.24 arc45 15.38,11.59 15.38,13.45 arc-50 15.47,13.65 v15.53,13.7
  Bottom 0.152: PCIE-SOUTH.A13 24.98,18.66 arc-45 24.72,18.77 24.59,18.9 arc45 24.32,19.01 17.51,19.01 arc45 17.3,18.92 15.47,17.09 arc45 15.38,16.87 15.38,13.95 arc45 15.45,13.78 v15.53,13.7
S_ML3_N
  Bottom 0.152: PCIE-SOUTH.A9 24.98,12.66 arc45 24.72,12.55 24.59,12.42 arc-45 24.32,12.31 17.58,12.31 arc45 17.23,12.17 16.23,11.17 arc-45 16.06,11.1 9.27,11.1 arc-45 9.09,11.17 X3.12
S_ML3_P
  Bottom 0.152: PCIE-SOUTH.A8 24.98,11.66 arc-45 24.72,11.77 24.59,11.9 arc45 24.32,12.01 17.62,12.01 arc45 17.41,11.92 16.44,10.94 arc-45 16.08,10.8 9.27,10.8 arc45 9.09,10.72 X3.10
S_PCIE_V  (via drill 0.25, 0.33)
  Top 0.203: R8.1 v9.48,17.45
  Top 0.61: PCIE-SOUTH.B13 17.22,18.66 arc-45 16.87,18.81 v15.48,20.2
  Route2 0.652: v15.48,20.2 14.18,20.2 arc45 13.83,20.05 11.37,17.59 arc-45 11.02,17.45 v9.48,17.45
  Bottom 0.406: C6.1 v6.18,5.7 6.18,7.29 arc45 6.03,7.64 5.37,8.3 arc45 5.02,8.45 4.73,8.45 arc-90 4.42,8.76 U4.1
  pour Route2: 9.73,17.44 arc-90 9.48,17.2 6.23,17.2 arc90 5.98,16.94 5.98,14.3 arc-45 5.9,14.12 5.8,14.02 arc45 5.73,13.84 5.73,8.05 arc45 5.8,7.87 5.9,7.77 arc-45 5.98,7.59 5.98,6.2 arc90 6.23,5.95 arc-90 6.48,5.7 arc-90 6.22,5.45 3.98,5.45 arc-90 3.48,5.96 3.48,17.19 arc-90 3.98,17.7 9.47,17.7 arc-90
S_PWR
  Bottom 0.406: X3.20 7.73,13.65 arc-45 7.38,13.79 7.25,13.93 arc45 6.89,14.07 6.3,14.07 6.18,13.95 | U4.5 4.42,13.2 arc-90 4.67,13.45 5.47,13.45 arc45 5.82,13.59 6.18,13.95 | C7.1 6.18,13.95
SCL
  Top 0.152: U1.6 20.57,33.73 arc-90 21.08,34.23 PCIE-NORTH.B2
SDA
  Top 0.152: U1.5 21.08,33.55 arc-90 21.34,33.8 23.75,33.8 arc-45 24.02,33.69 24.37,33.35 arc45 24.64,33.23 PCIE-NORTH.B1

### Text on the board
tDocu: HIGH SPEED IO
_bSilk: V1.2 / R1.4 | Triple mini DP / Dual Plugin Module | Copyright (C) 2016 Herbert Pötzl / Licensed under CERN OHL v.1.2
tEngrave: AXIOM BETA DPM 3xDP / TOP SIDE V1.2 R1.4
bEngrave: AXIOM BETA DPM 3xDP / BOTTOM SIDE V1.2 R1.4